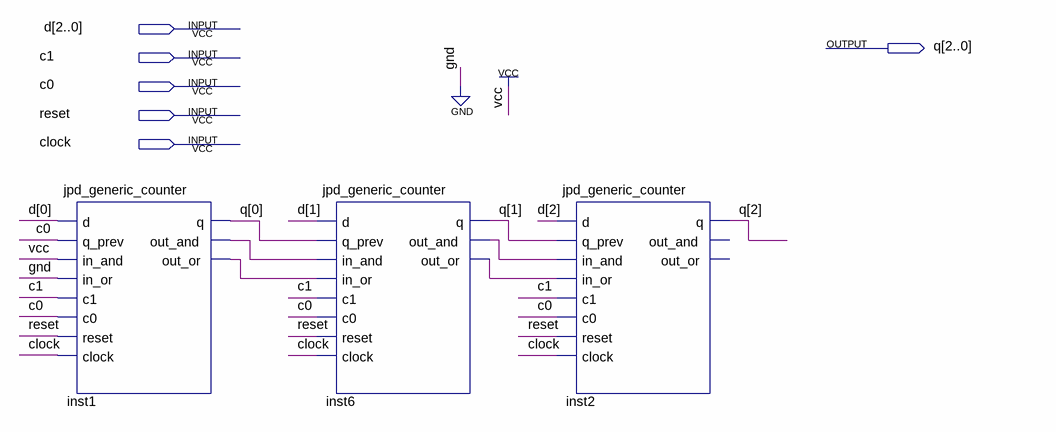
[diagram p0: schematic sheet]
// Quartus schematic jpd_generic_counter_3.bdf as structural Verilog: 3 symbols, 6 pins
module jpd_generic_counter_3 (
  input  [2:0] d,
  input  c1,
  input  c0,
  input  reset,
  input  clock,
  output [2:0] q
);

  wire inst1_out_and, inst1_out_or, inst6_out_and, inst6_out_or;

  jpd_generic_counter inst1 (
    .d(d[0]), .q_prev(c0), .in_and(1'b1), .in_or(1'b0), .c1(c1), .c0(c0), .reset(reset), .clock(clock),
    .q(q[0]), .out_and(inst1_out_and), .out_or(inst1_out_or));
  jpd_generic_counter inst6 (
    .d(d[1]), .q_prev(q[0]), .in_and(inst1_out_and), .in_or(inst1_out_or), .c1(c1), .c0(c0), .reset(reset),
    .clock(clock), .q(q[1]), .out_and(inst6_out_and), .out_or(inst6_out_or));
  jpd_generic_counter inst2 (
    .d(d[2]), .q_prev(q[1]), .in_and(inst6_out_and), .in_or(inst6_out_or), .c1(c1), .c0(c0), .reset(reset),
    .clock(clock), .q(q[2]));  // open: out_and, out_or
endmodule
